# EAGLE design untitled (EAGLE 9.6.1)
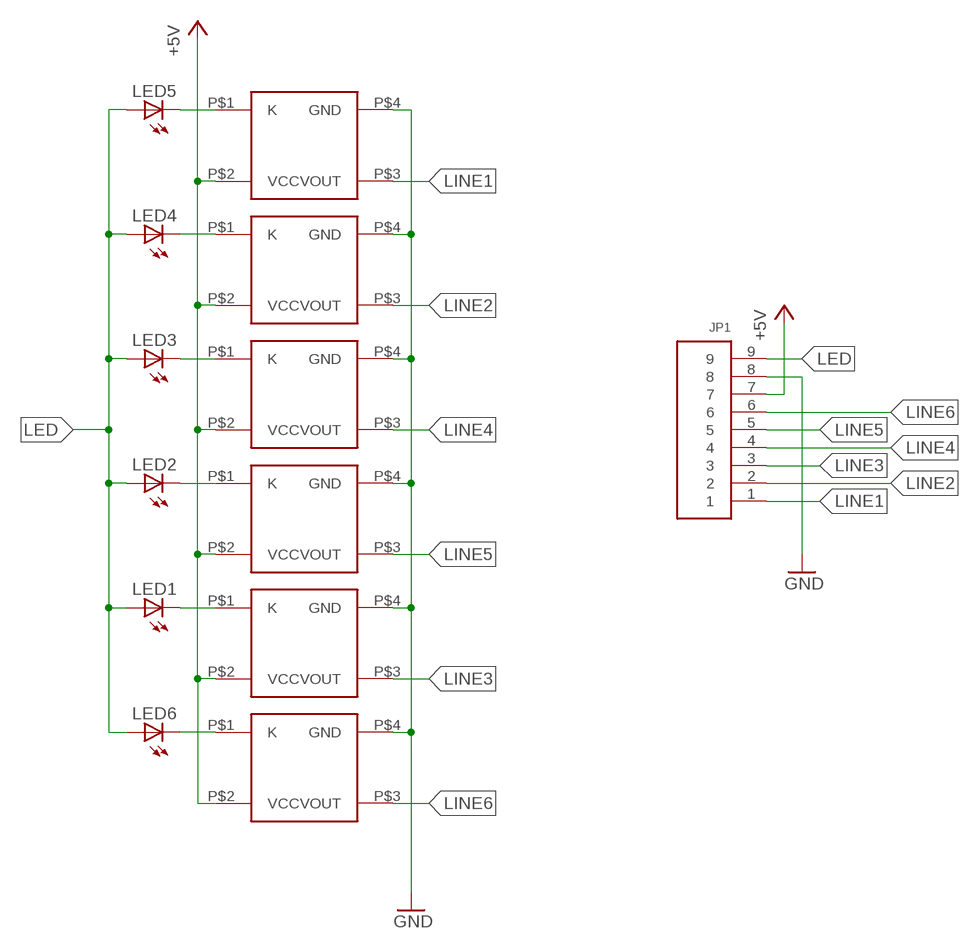
[diagram p0: schematic, sheet 1]

## Parts
JP1  9PIN  [B9B-PH-K-S]
LED1  LED5MM  [LED5MM]
LED2  LED5MM  [LED5MM]
LED3  LED5MM  [LED5MM]
LED4  LED5MM  [LED5MM]
LED5  LED5MM  [LED5MM]
LED6  LED5MM  [LED5MM]
U$1  S4282-51  [S4282-51]
U$2  S4282-51  [S4282-51]
U$3  S4282-51  [S4282-51]
U$4  S4282-51  [S4282-51]
U$5  S4282-51  [S4282-51]
U$6  S4282-51  [S4282-51]

## Nets
+5V: JP1.7 U$1.P$2(VCC) U$2.P$2(VCC) U$3.P$2(VCC) U$4.P$2(VCC) U$5.P$2(VCC) U$6.P$2(VCC)
GND: JP1.8 U$1.P$4(GND) U$2.P$4(GND) U$3.P$4(GND) U$4.P$4(GND) U$5.P$4(GND) U$6.P$4(GND)
LED: JP1.9 LED1.A LED2.A LED3.A LED4.A LED5.A LED6.A
LINE1: JP1.1 U$1.P$3(VOUT)
LINE2: JP1.2 U$2.P$3(VOUT)
LINE3: JP1.3 U$5.P$3(VOUT)
LINE4: JP1.4 U$3.P$3(VOUT)
LINE5: JP1.5 U$4.P$3(VOUT)
LINE6: JP1.6 U$6.P$3(VOUT)
N$1: LED5.K(C) U$1.P$1(K)
N$2: LED4.K(C) U$2.P$1(K)
N$3: LED3.K(C) U$3.P$1(K)
N$4: LED2.K(C) U$4.P$1(K)
N$5: LED1.K(C) U$5.P$1(K)
N$6: LED6.K(C) U$6.P$1(K)

## Library data of the parts
JP1 = jst_eph:9PIN
LED1-LED6 = adafruit:LED: LED OSRAM: - CHIPLED LG R971, LG N971, LY N971, LG Q971, LY Q971, LO R971, LY R971 LH N974, LH R974 LS Q976, LO Q976, LY Q976 LO Q996 - Hyper CHIPLED LW Q18S LB Q993, LB Q99A, LB R99A - SideLED LS A670, LO A670, LY A670, LG A670, LP A670 LB A673, LV A673, LT A673, LW A673 LH A674 LY A675 LS A676, LA A676, LO A676, LY A676, LW A676 LS A679, LY A679, LG A679 - Hyper Micro SIDELED® LS Y876, LA Y876, LO Y876, LY Y876 LT Y87S - SmartLED LW L88C, LW L88S LB L89C, LB L89S, LG L890 LS L89K, LO L89K, LY L89K LS L896, LA L896, LO L896, LY L896 - TOPLED LS T670, LO T670, LY T670, LG T670, LP T670 LSG T670, LSP T670, LSY T670, LOP T670, LYG T670 LG T671, LOG T671, LSG T671 LB T673, LV T673, LT T673, LW T673 LH T674 LS T676, LA T676, LO T676, LY T676, LB T676, LH T676, LSB T676, LW T676 LB T67C, LV T67C, LT T67C, LS T67K, LO T67K, LY T67K, LW E67C LS E67B, LA E67B, LO E67B, LY E67B, LB E67C, LV E67C, LT E67C LW T67C LS T679, LY T679, LG T679 LS T770, LO T770, LY T770, LG T770, LP T770 LB T773, LV T773, LT T773, LW T773 LH T774 LS E675, LA E675, LY E675, LS T675 LS T776, LA T776, LO T776, LY T776, LB T776 LHGB T686 LT T68C, LB T68C - Hyper Mini TOPLED® LB M676 - Mini TOPLED Santana® LG M470 LS M47K, LO M47K, LY M47K Source: http://www.osram.convergy.de/
U$1-U$6 = S4282-51:S4282-51

## Board
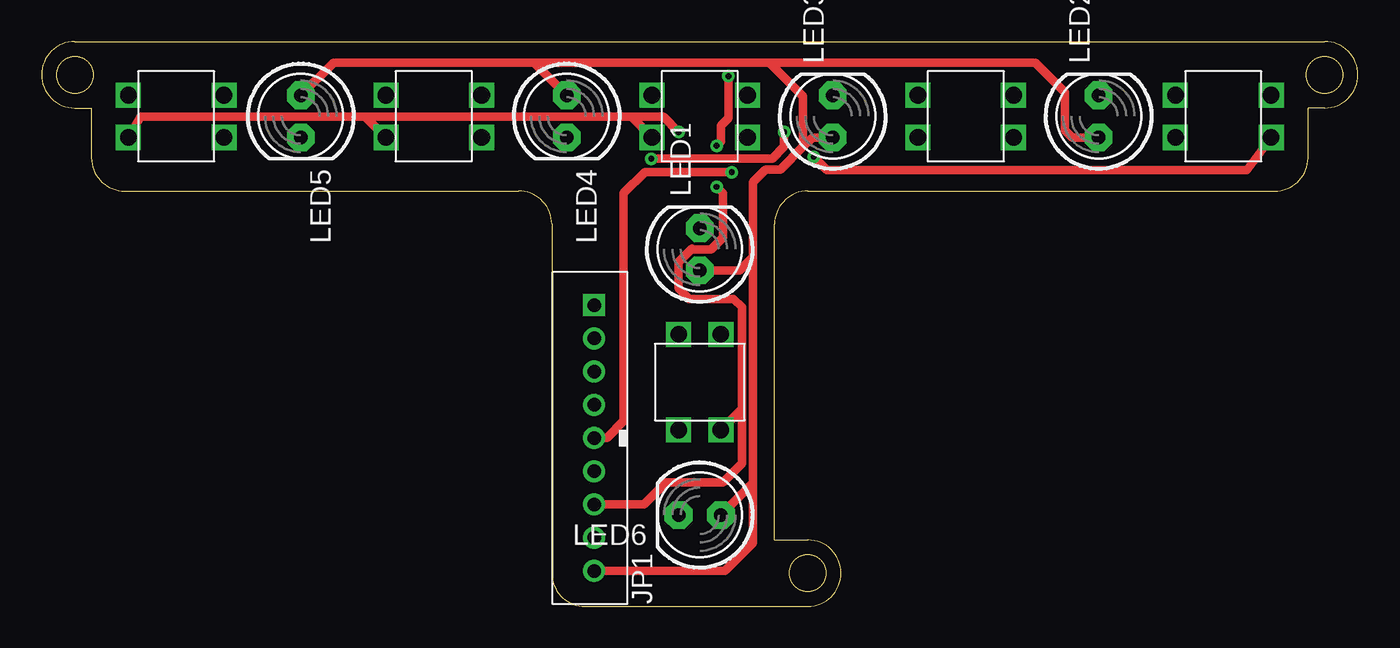
[diagram p1: board, top side]
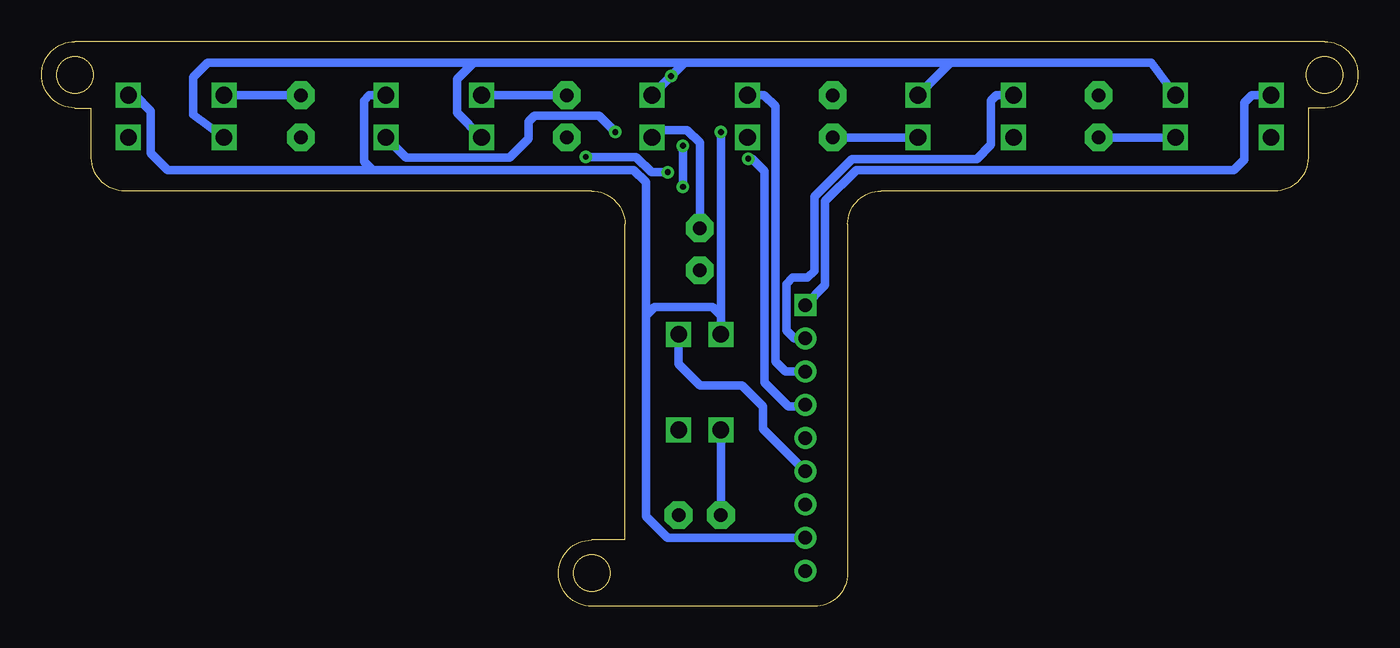
[diagram p2: board, bottom side, seen from below]

Size 79.2 x 34 mm. Coordinates in mm from the lower left corner, seen from the top.
Outline: 44.1,4 46.1,4 arc-180 46.1,0 32.7,0 arc-90 30.7,2 30.7,23 arc90 28.7,25 5,25 arc-90 3,27 3,30 2,30 arc-180 2,34 77.2,34 arc-180 77.2,30 76.2,30 76.2,27 arc-90 74.2,25 46.1,25 arc90 44.1,23 44.1,4
Outline: circle at 77.2,32 radius 1.1
Outline: circle at 2,32 radius 1.1
Outline: circle at 46.1,2 radius 1.1
Copper layers (1*16): Top 0.035mm / dielectric 1.5mm / Bottom 0.035mm
Design rules "default": minimum track width 6mil, minimum drill 0.35mm, track to track 6mil, track to pad 6mil, pad to pad 6mil, via to via 6mil, smd to smd 6mil, copper to edge 40mil, drill to drill 6mil, minimum pad ring 10mil, minimum via ring 8mil, stop-mask expansion 4mil, vias tented up to drill 0mil, thermal gap 10mil

### Footprints (pad centres in the part's own frame; a part is rotated, then mirrored left to right if it is on the bottom)
B9B-PH-K-S = drill 0.813 square: 1 8,0 | drill 0.813: 2 6,0; 3 4,0; 4 2,0; 5 0,0; 6 -2,0; 7 -4,0; 8 -6,0; 9 -8,0
LED5MM = drill 0.813 pad 1.676 octagon: A -1.27,0; K 1.27,0
S4282-51 = drill 1 square: P$1 -2.875,1.27; P$2 -2.875,-1.27; P$3 2.875,-1.27; P$4 2.875,1.27

### Placement (x,y rotation side)
JP1  33.25,10.14 90 top
LED1  39.6,21.5 90 top
LED2  63.6,29.5 90 top
LED3  47.6,29.5 90 top
LED4  31.6,29.5 270 top
LED5  15.6,29.5 270 top
LED6  39.6,5.5 180 top
U$1  8.1,29.5 180 top
U$2  23.6,29.5 180 top
U$3  55.6,29.5 0 top
U$4  71.1,29.5 0 top
U$5  39.6,29.5 180 top
U$6  39.6,13.5 90 top

### Tracks (layer width: path | path; a pad name or v marks a point on that pad's centre or on a via)
+5V  (via drill 0.35)
  Top 0.508: U$6.P$2 42.14,11.89 | 39.08,21.47 38.33,20.72 38.33,19.15 38.97,18.52 41.63,18.52 42.14,18.01 42.14,11.89 | 39.08,21.47 39.13,21.53 | 39.08,21.47 40.27,21.47 41,22.2 41,24.87 v40.62,25.25 | JP1.7 36.23,6.13 37.57,7.47 41,7.47 42.14,8.61 42.14,11.89 | v40.62,27.73 40.87,27.98 40.87,28.93 41.32,29.38 v41.32,31.92
  Bottom 0.508: U$1.P$2 12.43,32.73 24.52,32.73 | 24.52,32.73 U$2.P$2 | U$5.P$2 v41.32,31.92 40.88,32.37 | 40.88,32.37 40.52,32.73 | 24.52,32.73 40.52,32.73 | 40.52,32.73 53.2,32.73 | U$3.P$2 54.2,29.71 54.2,31.72 53.2,32.73 | 53.2,32.73 69.2,32.73 70.08,31.85 70.08,29.58 U$4.P$2 | 40.87,32.36 40.88,32.37 | v40.62,25.25 v40.62,27.73
GND  (via drill 0.35)
  Top 0.508: U$2.P$4 19.48,29.47 | 19.48,29.47 5.97,29.47 U$1.P$4 | 19.48,29.47 35.48,29.47 | 35.48,29.47 U$5.P$4 | 35.48,29.47 37.41,29.47 v38.33,28.55
  Bottom 0.508: 59.28,26.27 43.57,26.27 42.83,25.53 42.83,17.5 | 42.83,17.5 42.83,5.44 41.53,4.13 JP1.8 | U$3.P$4 59.48,30.77 59.79,30.45 59.79,26.78 59.28,26.27 | U$6.P$4 38.33,17.5 | 38.33,17.5 38.84,18.01 42.32,18.01 42.83,17.5 | v38.33,28.55 38.33,17.5 | U$4.P$4 73.57,30.77 72.62,29.82 72.62,27.28 71.61,26.27 59.28,26.27
LED
  Top 0.508: LED5.A 17.56,32.73 29.64,32.73 | 29.64,32.73 LED4.A | 43.8,32.73 45.82,30.71 45.82,27.66 | 29.64,32.73 43.8,32.73 | 43.8,32.73 59.8,32.73 61.57,30.96 61.57,28.68 62.02,28.23 LED2.A | 45.82,27.66 46.39,28.23 LED3.A | LED1.A 42,20.23 42.8,21.03 | 45.82,27.66 44.46,26.3 43.55,26.3 42.8,25.55 42.8,21.03 | LED6.A 42.8,7.43 | 42.8,21.03 42.8,7.43 | 42.8,7.43 42.8,3.81 41.12,2.13 JP1.9
LINE1
  Bottom 0.508: U$1.P$3 6.39,30.77 6.83,30.33 6.83,26.9 7.46,26.27 30.16,26.27 32.05,24.38 32.05,19.33 JP1.1
LINE2
  Bottom 0.508: U$2.P$3 21.76,30.77 22.07,30.45 22.07,27.79 22.93,26.93 30.44,26.93 32.71,24.66 32.71,20.2 33.12,19.79 34.01,19.79 34.39,19.41 34.39,16.61 33.92,16.14 JP1.2
LINE3
  Bottom 0.508: U$5.P$3 35.72,30.77 35.05,30.1 35.05,14.73 34.46,14.14 JP1.3
LINE4  (via drill 0.35)
  Top 0.508: v44.68,28.55 44.68,27.66 43.98,26.96 43.41,26.96 43.28,26.96 43.27,26.94 v36.68,26.94
  Bottom 0.508: U$3.P$3 57.27,27.03 51.03,27.03 49.89,28.17 49.89,29.19 49.55,29.53 45.66,29.53 v44.68,28.55 | JP1.4 33.34,12.04 34.27,12.04 35.71,13.49 35.71,26.19 36.47,26.94 v36.68,26.94
LINE5  (via drill 0.35)
  Top 0.508: U$4.P$3 72.52,26.27 47.24,26.27 v46.46,27.06 | v41.53,26.14 36.3,26.14 35.03,24.87 35.03,11.15 34.01,10.14 JP1.5
  Bottom 0.508: v46.46,27.06 43.42,27.06 42.51,26.14 v41.53,26.14
LINE6
  Bottom 0.508: JP1.6 35.79,10.67 35.79,12.04 37.06,13.31 39.6,13.31 40.87,14.58 U$6.P$3
N$1
  Bottom 0.508: U$1.P$1 LED5.K
N$2
  Bottom 0.508: U$2.P$1 LED4.K
N$3
  Bottom 0.508: LED3.K U$3.P$1
N$4
  Bottom 0.508: LED2.K U$4.P$1
N$5
  Bottom 0.508: U$5.P$1 42.03,28.68 40.36,28.68 39.6,27.92 LED1.K
N$6
  Bottom 0.508: U$6.P$1 LED6.K